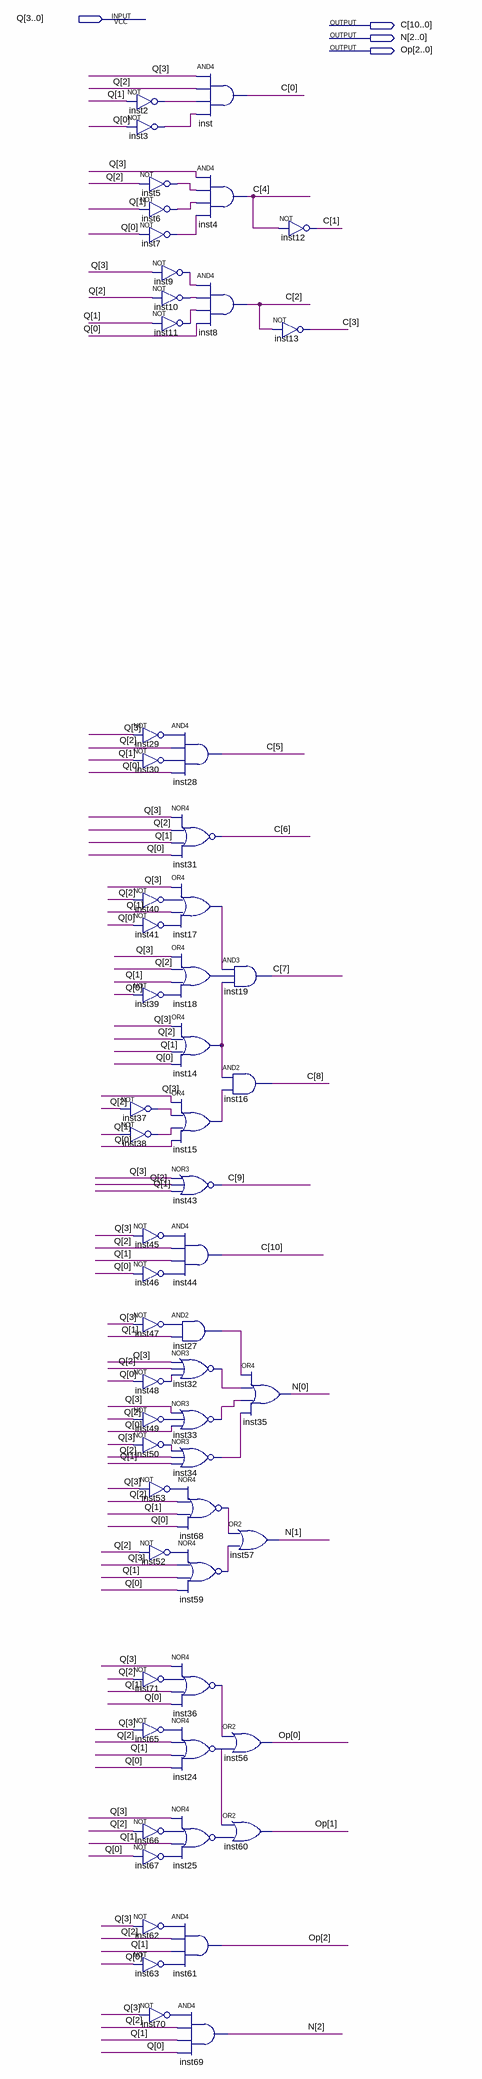
[diagram p0: schematic sheet]
// Quartus schematic Output_logic_version5.bdf as structural Verilog: 60 symbols, 4 pins
module Output_logic_version5 (
  input  [3:0] Q,
  output [10:0] C,
  output [2:0] N,
  output [2:0] Op
);

  wire inst2_out, inst3_out, inst5_out, inst6_out, inst7_out, inst9_out, inst10_out, inst11_out, inst14_out,
       inst15_out, inst17_out, inst18_out, inst24_out, inst25_out, inst27_out, inst29_out, inst30_out,
       inst32_out, inst33_out, inst34_out, inst36_out, inst37_out, inst38_out, inst39_out, inst40_out,
       inst41_out, inst45_out, inst46_out, inst47_out, inst48_out, inst49_out, inst50_out, inst52_out,
       inst53_out, inst59_out, inst62_out, inst63_out, inst65_out, inst66_out, inst67_out, inst68_out,
       inst70_out, inst71_out;

  not inst2 (inst2_out, Q[1]);
  not inst3 (inst3_out, Q[0]);
  not inst5 (inst5_out, Q[2]);
  not inst6 (inst6_out, Q[1]);
  not inst7 (inst7_out, Q[0]);
  not inst29 (inst29_out, Q[3]);
  not inst30 (inst30_out, Q[1]);
  not inst40 (inst40_out, Q[2]);
  not inst41 (inst41_out, Q[0]);
  not inst39 (inst39_out, Q[0]);
  not inst37 (inst37_out, Q[2]);
  not inst38 (inst38_out, Q[1]);
  not inst45 (inst45_out, Q[3]);
  not inst46 (inst46_out, Q[0]);
  not inst47 (inst47_out, Q[3]);
  not inst48 (inst48_out, Q[0]);
  not inst49 (inst49_out, Q[2]);
  not inst50 (inst50_out, Q[3]);
  not inst53 (inst53_out, Q[3]);
  not inst52 (inst52_out, Q[2]);
  not inst71 (inst71_out, Q[2]);
  not inst65 (inst65_out, Q[3]);
  not inst66 (inst66_out, Q[2]);
  not inst67 (inst67_out, Q[0]);
  not inst62 (inst62_out, Q[3]);
  not inst63 (inst63_out, Q[0]);
  not inst70 (inst70_out, Q[3]);
  not inst9 (inst9_out, Q[3]);
  not inst10 (inst10_out, Q[2]);
  not inst11 (inst11_out, Q[1]);
  and inst28 (C[5], inst29_out, Q[2], inst30_out, Q[0]);
  nor inst31 (C[6], Q[3], Q[2], Q[1], Q[0]);
  or inst17 (inst17_out, Q[3], inst40_out, Q[1], inst41_out);
  or inst18 (inst18_out, Q[3], Q[2], Q[1], inst39_out);
  or inst14 (inst14_out, Q[3], Q[2], Q[1], Q[0]);
  or inst15 (inst15_out, Q[3], inst37_out, inst38_out, Q[0]);
  nor inst43 (C[9], Q[3], Q[2], Q[1]);
  and inst44 (C[10], inst45_out, Q[2], Q[1], inst46_out);
  and inst27 (inst27_out, inst47_out, Q[1]);
  nor inst32 (inst32_out, Q[3], Q[2], inst48_out);
  nor inst33 (inst33_out, Q[3], inst49_out, Q[0]);
  nor inst34 (inst34_out, inst50_out, Q[2], Q[1]);
  nor inst68 (inst68_out, inst53_out, Q[2], Q[1], Q[0]);
  nor inst59 (inst59_out, inst52_out, Q[3], Q[1], Q[0]);
  nor inst36 (inst36_out, Q[3], inst71_out, Q[1], Q[0]);
  nor inst24 (inst24_out, inst65_out, Q[2], Q[1], Q[0]);
  nor inst25 (inst25_out, Q[3], inst66_out, Q[1], inst67_out);
  and inst61 (Op[2], inst62_out, Q[2], Q[1], inst63_out);
  and inst69 (N[2], inst70_out, Q[2], Q[1], Q[0]);
  and inst (C[0], Q[3], Q[2], inst2_out, inst3_out);
  and inst4 (C[4], Q[3], inst5_out, inst6_out, inst7_out);
  and inst8 (C[2], inst9_out, inst10_out, inst11_out, Q[0]);
  and inst19 (C[7], inst17_out, inst18_out, inst14_out);
  and inst16 (C[8], inst14_out, inst15_out);
  or inst35 (N[0], inst27_out, inst32_out, inst33_out, inst34_out);
  or inst57 (N[1], inst68_out, inst59_out);
  or inst56 (Op[0], inst36_out, inst24_out);
  or inst60 (Op[1], inst24_out, inst25_out);
  not inst12 (C[1], C[4]);
  not inst13 (C[3], C[2]);
endmodule
